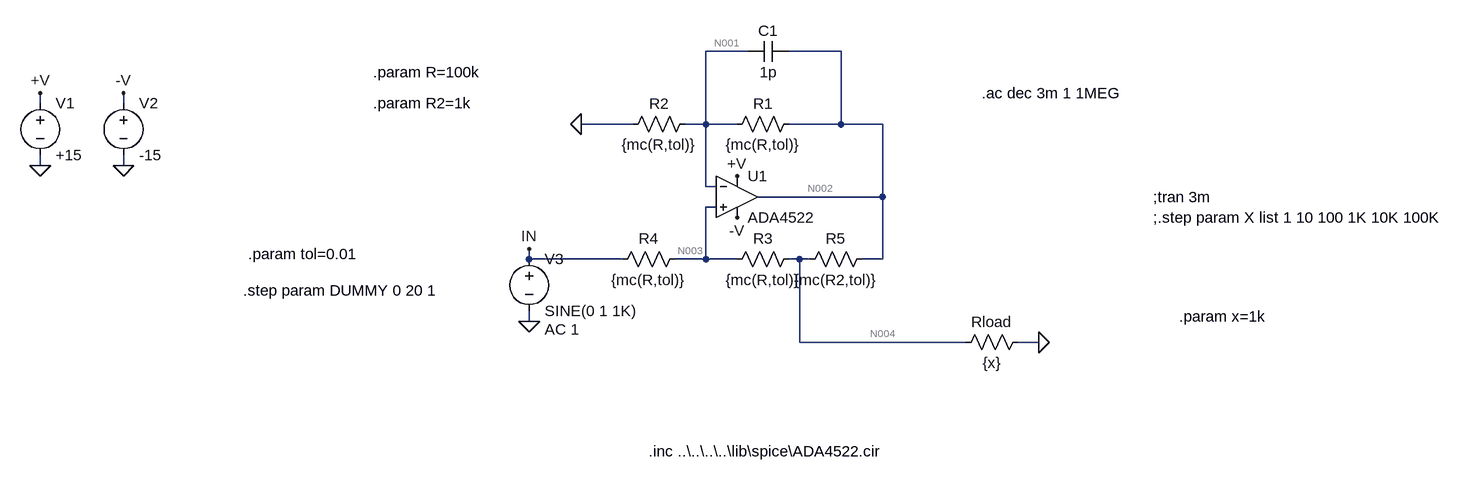
[diagram p0: schematic Howland_Improved_mc.asc]
Howland_Improved_mc.asc, the LTspice schematic file:
Version 4
SHEET 1 1288 696
WIRE 208 48 144 48
WIRE 352 48 272 48
WIRE -880 128 -880 112
WIRE -752 128 -752 112
WIRE 32 160 -48 160
WIRE 144 160 144 48
WIRE 144 160 112 160
WIRE 192 160 144 160
WIRE 352 160 352 48
WIRE 352 160 272 160
WIRE 416 160 352 160
WIRE -880 224 -880 208
WIRE -752 224 -752 208
WIRE 144 256 144 160
WIRE 160 256 144 256
WIRE 416 272 416 160
WIRE 416 272 224 272
WIRE 160 288 144 288
WIRE -128 368 -128 352
WIRE 16 368 -128 368
WIRE 144 368 144 288
WIRE 144 368 96 368
WIRE 192 368 144 368
WIRE 288 368 272 368
WIRE 304 368 288 368
WIRE 416 368 416 272
WIRE 416 368 384 368
WIRE -128 464 -128 448
WIRE 288 496 288 368
WIRE 544 496 288 496
WIRE 656 496 624 496
FLAG -752 224 0
FLAG -880 224 0
FLAG 192 240 +V
FLAG -880 112 +V
FLAG -752 112 -V
FLAG 192 304 -V
FLAG -128 464 0
FLAG -128 352 IN
FLAG 656 496 0
FLAG -48 160 0
SYMBOL voltage -880 112 R0
SYMATTR InstName V1
SYMATTR Value +15
SYMBOL voltage -752 112 R0
SYMATTR InstName V2
SYMATTR Value -15
SYMBOL res 288 144 R90
WINDOW 0 0 56 VBottom 2
WINDOW 3 32 56 VTop 2
SYMATTR InstName R1
SYMATTR Value {mc(R,tol)}
SYMBOL res 128 144 R90
WINDOW 0 0 56 VBottom 2
WINDOW 3 32 56 VTop 2
SYMATTR InstName R2
SYMATTR Value {mc(R,tol)}
SYMATTR SpiceLine tol=tol
SYMBOL voltage -128 352 R0
WINDOW 123 24 124 Left 2
WINDOW 39 0 0 Left 2
SYMATTR Value2 AC 1
SYMATTR InstName V3
SYMATTR Value SINE(0 1 1K)
SYMBOL res 288 352 R90
WINDOW 0 0 56 VBottom 2
WINDOW 3 32 56 VTop 2
SYMATTR InstName R3
SYMATTR Value {mc(R,tol)}
SYMBOL res 112 352 R90
WINDOW 0 0 56 VBottom 2
WINDOW 3 32 56 VTop 2
SYMATTR InstName R4
SYMATTR Value {mc(R,tol)}
SYMBOL res 528 512 R270
WINDOW 0 32 56 VTop 2
WINDOW 3 0 56 VBottom 2
SYMATTR InstName Rload
SYMATTR Value {x}
SYMBOL res 400 352 R90
WINDOW 0 0 56 VBottom 2
WINDOW 3 32 56 VTop 2
SYMATTR InstName R5
SYMATTR Value {mc(R2,tol)}
SYMBOL Opamps\\opamp2 192 208 R0
SYMATTR InstName U1
SYMATTR Value ADA4522
SYMBOL cap 272 32 R90
WINDOW 0 0 32 VBottom 2
WINDOW 3 32 32 VTop 2
SYMATTR InstName C1
SYMATTR Value 1p
TEXT 832 272 Left 2 !;tran 3m
TEXT 832 304 Left 2 !;.step param X list 1 10 100 1K 10K 100K
TEXT -368 80 Left 2 !.param R=100k
TEXT -368 128 Left 2 !.param R2=1k
TEXT 56 664 Left 2 !.inc ..\\..\\..\\..\\lib\\spice\\ADA4522.cir
TEXT 568 112 Left 2 !.ac dec 3m 1 1MEG
TEXT -560 360 Left 2 !.param tol=0.01
TEXT -568 416 Left 2 !.step param DUMMY 0 20 1
TEXT 872 456 Left 2 !.param x=1k

The netlist it stands for:
* Howland_Improved_mc.asc
V1 +V 0 +15
V2 -V 0 -15
R1 N002 N001 {mc(R,tol)}
R2 N001 0 {mc(R,tol)} tol=tol
V3 IN 0 SINE(0 1 1K) AC 1
R3 N004 N003 {mc(R,tol)}
R4 N003 IN {mc(R,tol)}
Rload N004 0 {x}
R5 N002 N004 {mc(R2,tol)}
XU1 N003 N001 +V -V N002 ADA4522  ; pins In+ In- V+ V- OUT
C1 N002 N001 1p
;tran 3m
;.step param X list 1 10 100 1K 10K 100K
.param R=100k
.param R2=1k
.inc ..\..\..\..\lib\spice\ADA4522.cir
.ac dec 3m 1 1MEG
.param tol=0.01
.step param DUMMY 0 20 1
.param x=1k
.backanno
.end

* Results of the author's LTspice run, read from the files saved beside the schematic
* Operating Point (first step), zero values left out:
*   V(+v) = 15 V
*   V(-v) = -15 V
*   V(n002) = -20.94 µV
*   V(n001) = -5.661 µV
*   V(n004) = -10.46 µV
*   V(n003) = -10.37 µV
*   I(R5) = -10.46 nA
*   I(Rload) = -10.46 nA
*   I(R4) = -103.1 pA
*   I(R2) = -56.54 pA
*   I(R1) = -154.3 pA
*   I(V3) = -103.1 pA
*   I(V2) = 895.9 µA
*   I(V1) = -895.9 µA
*   Ix(u1:1) = 102.2 pA
*   Ix(u1:2) = -97.82 pA
*   Ix(u1:99) = 895.9 µA
*   Ix(u1:50) = -895.9 µA
*   Ix(u1:45) = 10.62 nA
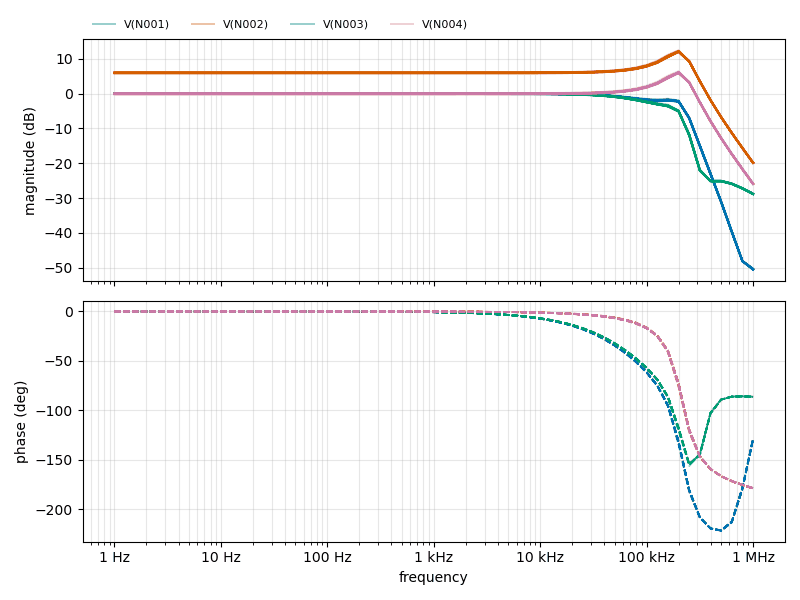
[diagram p1: AC Analysis of Howland_Improved_mc.asc, plotted from the saved traces]
* AC Analysis, 21 runs:
*   V(N001) [run 1]: -0.06 dB at 1 Hz, -50.62 dB at 1 MHz, peak -0.06 dB at 1.259 Hz, 3 dB below the peak at 207.8 kHz
*   V(N001) [run 2]: -0.01 dB at 1 Hz, -50.53 dB at 1 MHz, peak -0.01 dB at 1 Hz, 3 dB below the peak at 206.4 kHz
*   V(N001) [run 3]: -0.04 dB at 1 Hz, -50.53 dB at 1 MHz, peak -0.04 dB at 1 Hz, 3 dB below the peak at 208.2 kHz
*   V(N001) [run 4]: 0.09 dB at 1 Hz, -50.31 dB at 1 MHz, peak 0.09 dB at 1 Hz, 3 dB below the peak at 208.4 kHz
*   V(N001) [run 5]: -0.02 dB at 1 Hz, -50.51 dB at 1 MHz, peak -0.02 dB at 1 Hz, 3 dB below the peak at 207.6 kHz
*   V(N001) [run 6]: -0.00 dB at 1 Hz, -50.51 dB at 1 MHz, peak -0.00 dB at 1.259 Hz, 3 dB below the peak at 208.3 kHz
*   V(N001) [run 7]: 0.01 dB at 1 Hz, -50.48 dB at 1 MHz, peak 0.01 dB at 1 Hz, 3 dB below the peak at 206.6 kHz
*   V(N001) [run 8]: -0.00 dB at 1 Hz, -50.60 dB at 1 MHz, peak -0.00 dB at 1 Hz, 3 dB below the peak at 207.1 kHz
*   V(N002) [run 1]: 5.92 dB at 1 Hz, -19.89 dB at 1 MHz, peak 11.99 dB at 199.5 kHz, 3 dB below the peak at 128 kHz and 254.8 kHz
*   V(N002) [run 2]: 6.02 dB at 1 Hz, -19.90 dB at 1 MHz, peak 11.99 dB at 199.5 kHz, 3 dB below the peak at 127.1 kHz and 254.4 kHz
*   V(N002) [run 3]: 5.92 dB at 1 Hz, -19.84 dB at 1 MHz, peak 12.06 dB at 199.5 kHz, 3 dB below the peak at 128.7 kHz and 254.8 kHz
*   V(N002) [run 4]: 6.16 dB at 1 Hz, -19.78 dB at 1 MHz, peak 12.46 dB at 199.5 kHz, 3 dB below the peak at 125.9 kHz and 247.9 kHz
*   V(N002) [run 5]: 5.98 dB at 1 Hz, -19.86 dB at 1 MHz, peak 12.08 dB at 199.5 kHz, 3 dB below the peak at 127.7 kHz and 253.9 kHz
*   V(N002) [run 6]: 5.97 dB at 1 Hz, -19.82 dB at 1 MHz, peak 12.13 dB at 199.5 kHz, 3 dB below the peak at 128.2 kHz and 253.9 kHz
*   V(N002) [run 7]: 6.04 dB at 1 Hz, -19.92 dB at 1 MHz, peak 12.11 dB at 199.5 kHz, 3 dB below the peak at 126.7 kHz and 252.4 kHz
*   V(N002) [run 8]: 5.99 dB at 1 Hz, -19.91 dB at 1 MHz, peak 12.02 dB at 199.5 kHz, 3 dB below the peak at 127 kHz and 253.8 kHz
*   V(N003) [run 1]: -0.06 dB at 1 Hz, -28.87 dB at 1 MHz, peak -0.06 dB at 1.259 Hz, 3 dB below the peak at 124.8 kHz
*   V(N003) [run 2]: -0.01 dB at 1 Hz, -28.87 dB at 1 MHz, peak -0.01 dB at 1 Hz, 3 dB below the peak at 121.4 kHz
*   V(N003) [run 3]: -0.04 dB at 1 Hz, -28.82 dB at 1 MHz, peak -0.04 dB at 1 Hz, 3 dB below the peak at 124.9 kHz
*   V(N003) [run 4]: 0.09 dB at 1 Hz, -28.73 dB at 1 MHz, peak 0.09 dB at 1 Hz, 3 dB below the peak at 141.7 kHz
*   V(N003) [run 5]: -0.02 dB at 1 Hz, -28.83 dB at 1 MHz, peak -0.02 dB at 1 Hz, 3 dB below the peak at 125.4 kHz
*   V(N003) [run 6]: -0.00 dB at 1 Hz, -28.79 dB at 1 MHz, peak -0.00 dB at 1.259 Hz, 3 dB below the peak at 127.9 kHz
*   V(N003) [run 7]: 0.01 dB at 1 Hz, -28.88 dB at 1 MHz, peak 0.01 dB at 1 Hz, 3 dB below the peak at 124.5 kHz
*   V(N003) [run 8]: -0.00 dB at 1 Hz, -28.88 dB at 1 MHz, peak -0.00 dB at 1 Hz, 3 dB below the peak at 125.2 kHz
*   V(N004) [run 1]: -0.11 dB at 1 Hz, -25.97 dB at 1 MHz, peak 5.92 dB at 199.5 kHz, 3 dB below the peak at 127.9 kHz and 254.8 kHz
*   V(N004) [run 2]: -0.02 dB at 1 Hz, -25.98 dB at 1 MHz, peak 5.91 dB at 199.5 kHz, 3 dB below the peak at 127 kHz and 254.4 kHz
*   V(N004) [run 3]: -0.08 dB at 1 Hz, -25.89 dB at 1 MHz, peak 6.03 dB at 199.5 kHz, 3 dB below the peak at 128.6 kHz and 254.8 kHz
*   V(N004) [run 4]: 0.18 dB at 1 Hz, -25.80 dB at 1 MHz, peak 6.45 dB at 199.5 kHz, 3 dB below the peak at 125.8 kHz and 247.9 kHz
*   V(N004) [run 5]: -0.05 dB at 1 Hz, -25.93 dB at 1 MHz, peak 6.01 dB at 199.5 kHz, 3 dB below the peak at 127.6 kHz and 253.9 kHz
*   V(N004) [run 6]: -0.01 dB at 1 Hz, -25.85 dB at 1 MHz, peak 6.11 dB at 199.5 kHz, 3 dB below the peak at 128 kHz and 253.9 kHz
*   V(N004) [run 7]: 0.02 dB at 1 Hz, -25.99 dB at 1 MHz, peak 6.05 dB at 199.5 kHz, 3 dB below the peak at 126.5 kHz and 252.4 kHz
*   V(N004) [run 8]: -0.01 dB at 1 Hz, -25.95 dB at 1 MHz, peak 5.99 dB at 199.5 kHz, 3 dB below the peak at 126.9 kHz and 253.7 kHz